# EAGLE design door_FM_rev_A (EAGLE 9.5.2)
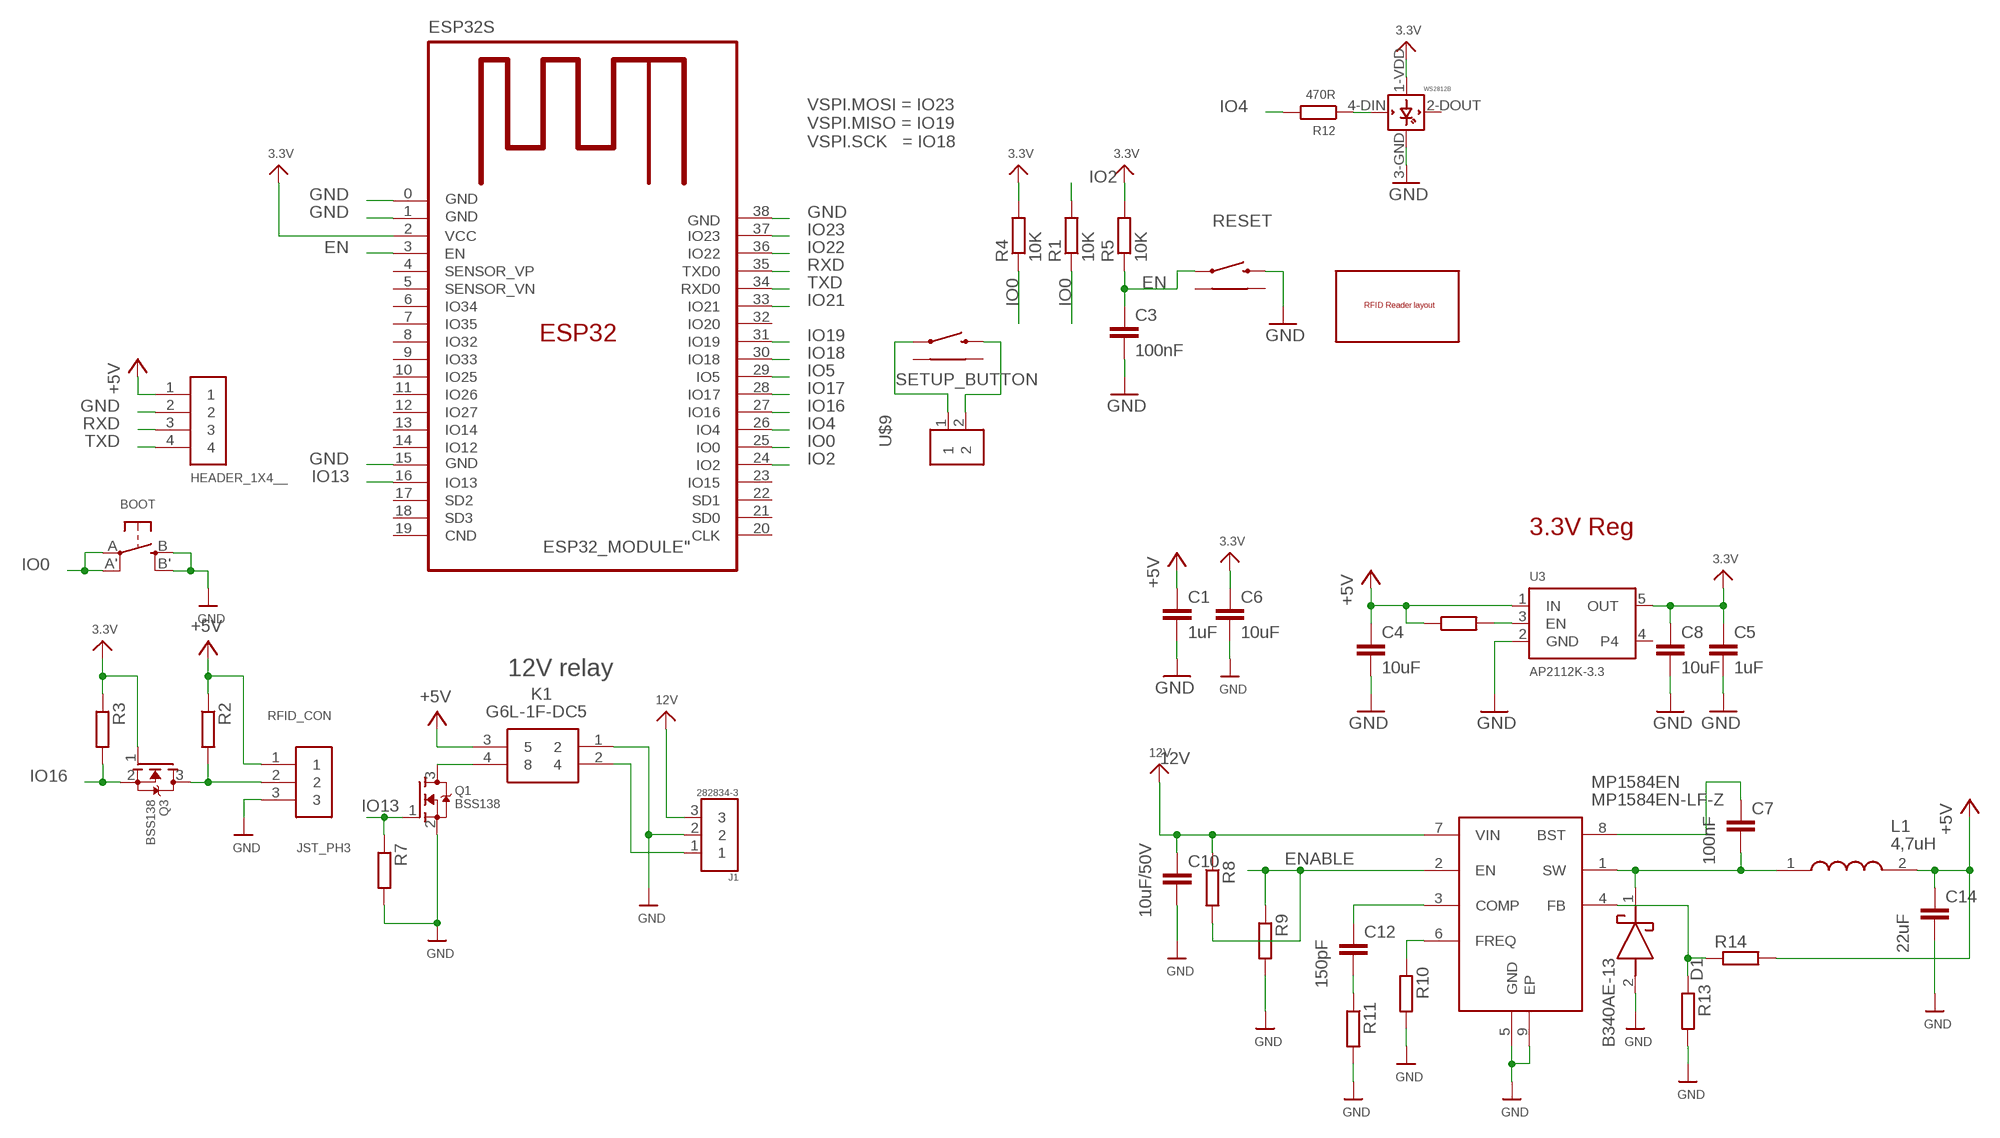
[diagram p0: schematic, sheet 1]

## Parts
BOOT  BUTTON_KMR2_4.6X2.8  [BUTTON_KMR2_4.6X2.8]
C1  1uF  C-EUC0805  [C0805]
C3  100nF  C-EUC0805  [C0805]
C4  10uF  C-EUC0805  [C0805]
C5  1uF  C-EUC0805  [C0805]
C6  10uF  C-EUC0805  [C0805]
C7  100nF  C-EUC0805  [C0805]
C8  10uF  C-EUC0805  [C0805]
C10  10uF/50V  C-EUC0805  [C0805]
C12  150pF  C-EUC0805  [C0805]
C14  22uF  C-EUC0805  [C0805]
CN1  HEADER_1X4__  [HEADER_1X4_RIGHT_ANGLE]
D1  B340AE-13  [DIOM5226X240N]
ESP32S  ESP32_MODULE"  [ESP32_MODULE]
J1  282834-3  [TE_282834-3]
K1  G6L-1F-DC5  [G6L-1F-DC5]
L1  4,7uH  ASPI-0630LR-4R7M-T15  [ASPI-0630LR]
MP1584EN  MP1584EN-LF-Z  [SOIC127P600X170-9N]
Q1  BSS138  MOSFET_N_  [SOT95P240X110-3]
Q3  BSS138  MOSFET_N_  [SOT95P240X110-3]
R1  10K  R-EU_R0805  [R0805]
R2  10K  R-EU_R0805  [R0805]
R3  10K  R-EU_R0805  [R0805]
R4  10K  R-EU_R0805  [R0805]
R5  10K  R-EU_R0805  [R0805]
R7  10K  R-EU_R0805  [R0805]
R8  100K  R-EU_R0805  [R0805]
R9  24,9K  R-EU_R0805  [R0805]
R10  100K  R-EU_R0805  [R0805]
R11  100K  R-EU_R0805  [R0805]
R12  470R  R-EU_R0805  [R0805]
R13  40,2K  R-EU_R0805  [R0805]
R14  210K  R-EU_R0805  [R0805]
R19  10K  R-EU_R0805  [R0805]
RESET  TACTILE_SWITCH_RIGHT_ANGLE_THT_  [TACTILE_SWITCH_RIGHT_ANGLE_THT]
RFID_CON  JST_PH3  [JST-PH3]
SETUP_BUTTON  TACTILE_SWITCH_RIGHT_ANGLE_THT_  [TACTILE_SWITCH_RIGHT_ANGLE_THT]
U3  AP2112K-3.3  AP2112K-3.3_  [SOT95P290X120-5]
U$9  282834-2  [CONN_282834-2]
U$10  RFID_READER  [RFID_READER]
WS2812B  WS2812B__  [WS2812B_5050]

## Nets
3.3V: C5.1 C6.1 C8.1 ESP32S.2(VCC) Q3.1(G) R3.1 R4.2 R5.2 U3.5(OUT) WS2812B.1-VDD(VDD)
12V: C10.1 J1.3 MP1584EN.7(VIN) R8.1
+5V: C1.1 C4.1 C14.1 CN1.1 K1.3 L1.2 R2.1 R14.2 R19.1 RFID_CON.1 U3.1(IN)
EN: C3.1 ESP32S.3(EN) R5.1 RESET.1
ENABLE: MP1584EN.2(EN) R8.2 R9.1
GND: BOOT.B'(S1) BOOT.B(S) C1.2 C3.2 C4.2 C5.2 C6.2 C8.2 C10.2 C14.2 CN1.2 D1.2(A) ESP32S.0(GND) ESP32S.1(GND) ESP32S.15(GND) ESP32S.38(GND) J1.2 K1.1 MP1584EN.5(GND) MP1584EN.9(EP) Q1.2(S) R7.2 R9.2 R10.2 R11.2 R13.2 RESET.2 RFID_CON.3 U3.2(GND) WS2812B.3-GND(GND)
IO0: BOOT.A'(P1) BOOT.A(P) ESP32S.25(IO0) R1.1 R4.1
IO2: ESP32S.24(IO2) R1.2
IO4: ESP32S.26(IO4) R12.2
IO5: ESP32S.29(IO5)
IO13: ESP32S.16(IO13) Q1.1(G) R7.1
IO16: ESP32S.27(IO16) Q3.2(S) R3.2
IO17: ESP32S.28(IO17)
IO18: ESP32S.30(IO18)
IO19: ESP32S.31(IO19)
IO21: ESP32S.33(IO21)
IO22: ESP32S.36(IO22)
IO23: ESP32S.37(IO23)
N$1: K1.4 Q1.3(D)
N$2: SETUP_BUTTON.1 U$9.1
N$3: SETUP_BUTTON.2 U$9.2
N$5: J1.1 K1.2
N$6: MP1584EN.6(FREQ) R10.1
N$7: Q3.3(D) R2.2 RFID_CON.2
N$8: C12.2 R11.1
N$9: C12.1 MP1584EN.3(COMP)
N$10: R12.1 WS2812B.4-DIN(DIN)
N$11: MP1584EN.4(FB) R13.1 R14.1
N$12: C7.2 D1.1(K) L1.1 MP1584EN.1(SW)
N$13: C7.1 MP1584EN.8(BST)
N$16: R19.2 U3.3(EN)
RXD: CN1.3 ESP32S.35(TXD0)
TXD: CN1.4 ESP32S.34(RXD0)
Unconnected: ESP32S.4(SENSOR_VP) ESP32S.5(SENSOR_VN) ESP32S.6(IO34) ESP32S.7(IO35) ESP32S.8(IO32) ESP32S.9(IO33) ESP32S.10(IO25) ESP32S.11(IO26) ESP32S.12(IO27) ESP32S.13(IO14) ESP32S.14(IO12) ESP32S.17(SD2) ESP32S.18(SD3) ESP32S.19(CND) ESP32S.20(CLK) ESP32S.21(SD0) ESP32S.22(SD1) ESP32S.23(IO15) ESP32S.32(IO20) RESET.ANCHOR1 RESET.ANCHOR2 SETUP_BUTTON.ANCHOR1 SETUP_BUTTON.ANCHOR2 U3.4 WS2812B.2-DOUT(DOUT)

## Notes on the sheet
- VSPI.MOSI = IO23
  VSPI.MISO = IO19
  VSPI.SCK   = IO18
- 3.3V Reg
- 12V relay

## Library data of the parts
BOOT = dronecz:BUTTON_KMR2_4.6X2.8: SMT Tact Switches 6x6mm - Digikey: P12940SCT-ND KMR2 (4.6x2.8mm) - Digikey: 401-1426-1-ND EVQ-PQHB55 - Light Touch, 160GF (4.5x4.5mm) - Digikey: P8090SCT-ND Farnell (KMR221NG) - 2845727
C1 C3-C8 C10 C12 C14 = rcl:C-EU: CAPACITOR, European symbol; SPICEPREFIX: C
CN1 = dronecz:HEADER_1X4
D1 = samacsys_parts:B340AE-13: Schottky Diodes & Rectifiers Schottky Rectifier. 40V; 3A Source: Datasheet <https://componentsearchengine.com/Datasheets/1/B340AE-13.pdf>; DESCRIPTION: Schottky Diodes & Rectifiers Schottky Rectifier. 40V; 3A; HEIGHT: 2.4mm; MANUFACTURER_NAME: Diodes Inc.; MANUFACTURER_PART_NUMBER: B340AE-13; MOUSER_PART_NUMBER: 621-B340AE-13; MOUSER_PRICE-STOCK: https://www.mouser.com/Search/Refine.aspx?Keyword=621-B340AE-13
ESP32S = dronecz:ESP32_MODULE
J1 = dronecz:282834-3: Conn; Term Blk; PCB; Wire Receptacle; 3; 2.54mm; 30-16AWG; Green; 10A; 150V; M1.6; AVAILABILITY: Unavailable; COMMENT: 282834-3; DESCRIPTION: 3 Position Wire to Board Terminal Block Horizontal with Board 0.100 _2.54mm_; EU_ROHS_COMPLIANCE: Compliant with Exemptions; MF: TE Connectivity; MP: 282834-3; PACKAGE: None; PRICE: None; TE_PURCHASE_URL: https://www.te.com/usa-en/product-282834-3.html?te_bu=Cor&te_type=disp&te_campaign=seda_glo_cor-seda-global-disp-prtnr-fy19-seda-model-bom-cta_sma-317_1&elqCampaignId=32493
K1 = dronecz:G6L-1F-DC5: Low Signal Relays - PCB LO PROF SPST 5VDC Source: Datasheet <https://componentsearchengine.com/Datasheets/1/G6L-1F-DC5.pdf>; DESCRIPTION: Low Signal Relays - PCB LO PROF SPST 5VDC; HEIGHT: mm; MANUFACTURER_NAME: Omron Electronics; MANUFACTURER_PART_NUMBER: G6L-1F-DC5; MOUSER_PART_NUMBER: 653-G6L-1F-DC5; MOUSER_PRICE-STOCK: https://www.mouser.com/Search/Refine.aspx?Keyword=653-G6L-1F-DC5
L1 = samacsys_parts:ASPI-0630LR-4R7M-T15: Fixed Inductors 4.7uH 20% -55C +125C Source: Datasheet <https://componentsearchengine.com/Datasheets/1/ASPI-0630LR-4R7M-T15.pdf>; DESCRIPTION: Fixed Inductors 4.7uH 20% -55C +125C; HEIGHT: mm; MANUFACTURER_NAME: ABRACON; MANUFACTURER_PART_NUMBER: ASPI-0630LR-4R7M-T15; MOUSER_PART_NUMBER: 815-ASPI0630LR4R7T15; MOUSER_PRICE-STOCK: https://www.mouser.com/Search/Refine.aspx?Keyword=815-ASPI0630LR4R7T15
MP1584EN = samacsys_parts:MP1584EN-LF-Z: Switching Voltage Regulators 3A 1.5MHz 28V Nonsync Buck Source: Datasheet <https://componentsearchengine.com/Datasheets/1/MP1584EN-LF-Z.pdf>; DESCRIPTION: Switching Voltage Regulators 3A 1.5MHz 28V Nonsync Buck; HEIGHT: 1.7mm; MANUFACTURER_NAME: Monolithic Power Systems (MPS); MANUFACTURER_PART_NUMBER: MP1584EN-LF-Z; MOUSER_PART_NUMBER: 946-MP1584ENLFZ; MOUSER_PRICE-STOCK: https://www.mouser.com/Search/Refine.aspx?Keyword=946-MP1584ENLFZ
Q1 Q3 = dronecz:MOSFET_N
R1-R5 R7-R14 R19 = rcl:R-EU_: RESISTOR, European symbol; SPICEPREFIX: R
RESET SETUP_BUTTON = dronecz:TACTILE_SWITCH_RIGHT_ANGLE_THT
RFID_CON = dronecz:JST_PH3
U3 = dronecz:AP2112K-3.3
U$9 = dronecz:282834-2: Terminal block; 2.54mm; angled 90°; 0.03÷1mm2; ways: 2; 10A; H: 10mm; AVAILABILITY: Unavailable; CENTERLINE_PITCH: 2.54 mm[.1 in]; COMMENT: 282834-2; DESCRIPTION: Wire-To-Board Terminal Block, 2, 150 V, 10 A, 30 Awg, 16 Awg, 1.4 Mm; EU_ROHS_COMPLIANCE: Compliant with Exemptions; MF: TE Connectivity; MP: 282834-2; NUMBER_OF_POSITIONS: 2; PACKAGE: None; PRICE: None; TE_PURCHASE_URL: https://www.te.com/usa-en/product-282834-2.html?te_bu=Cor&te_type=disp&te_campaign=seda_glo_cor-seda-global-disp-prtnr-fy19-seda-model-bom-cta_sma-317_1&elqCampaignId=32493
U$10 = dronecz:RFID_READER
WS2812B = dronecz:WS2812B

## Net classes
1 power: width 0.61 mm, drill 0.406 mm, clearance 0.203 mm
2 gnd: width 0.305 mm, drill 0.406 mm, clearance 0.203 mm
3 power usb: width 0.508 mm, drill 0.406 mm, clearance 0.203 mm

## Board
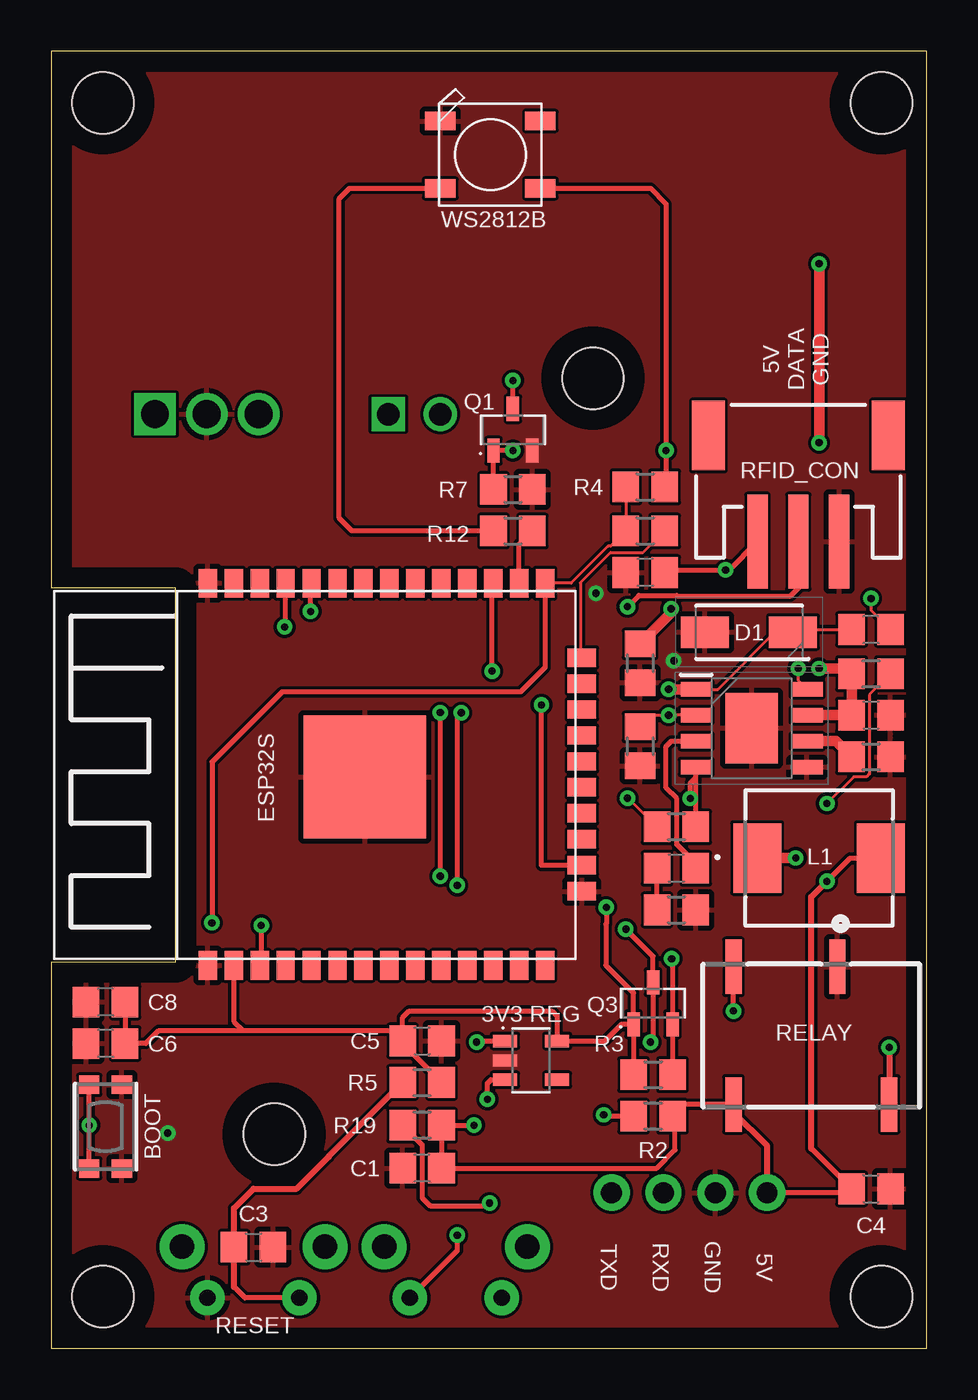
[diagram p1: board, top side]
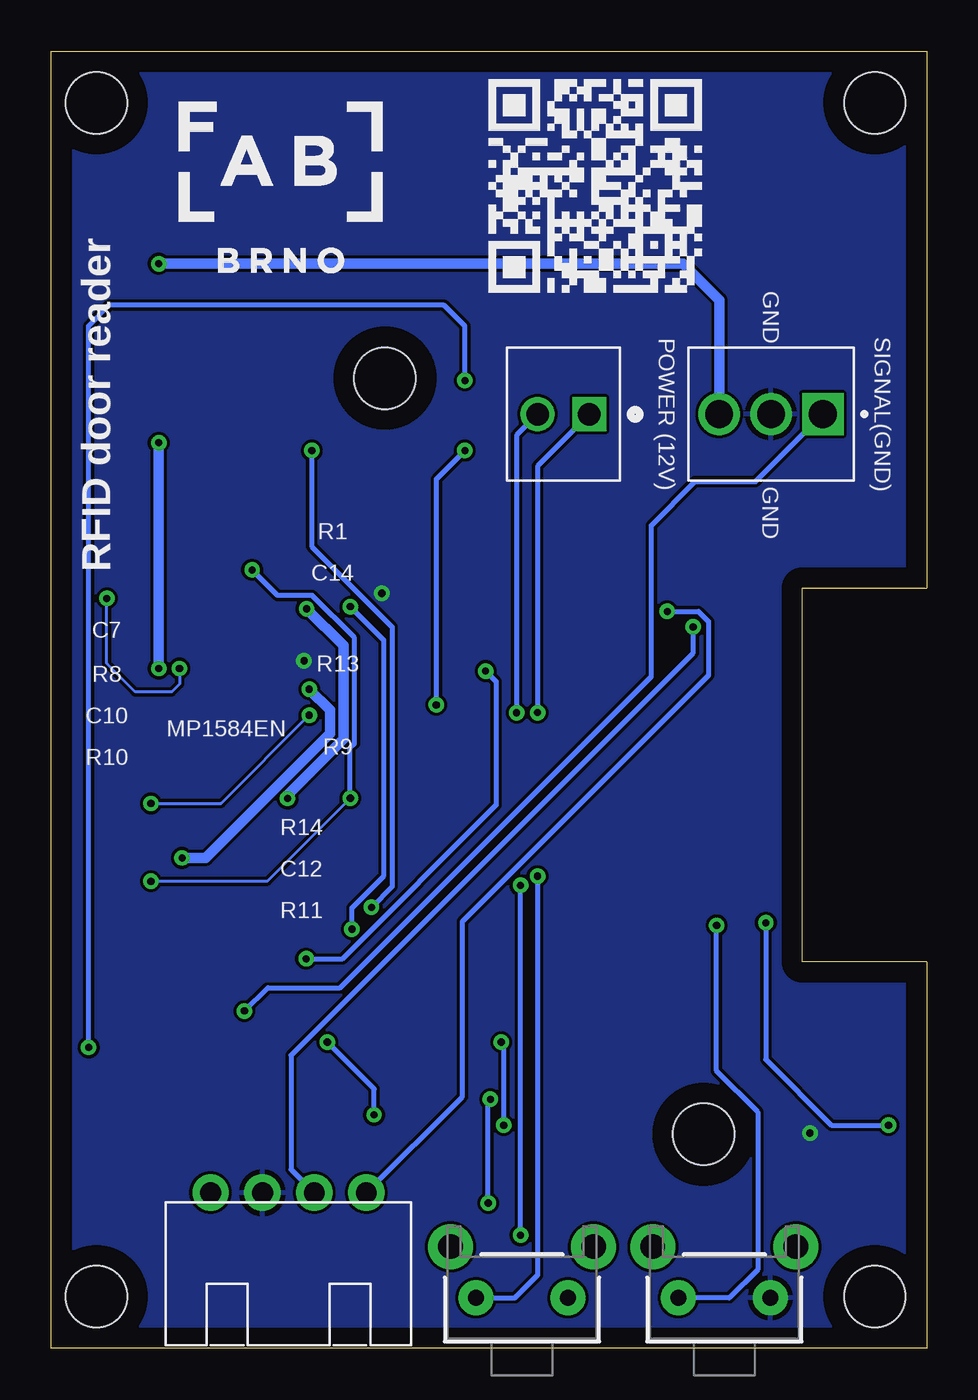
[diagram p2: board, bottom side, seen from below]

Size 42.86 x 63.49 mm. Coordinates in mm from the lower left corner, seen from the top.
Outline: 0,0 42.86,0 42.86,63.49 0,63.49 0,37.21 6.1,37.21 6.1,18.92 0,18.92 0,0
Copper layers (1*16): Top 0.035mm / dielectric 1.5mm / Bottom 0.035mm
Design rules "default": minimum track width 6mil, minimum drill 0.35mm, track to track 6mil, track to pad 6mil, pad to pad 6mil, via to via 6mil, smd to smd 6mil, copper to edge 40mil, drill to drill 6mil, minimum pad ring 10mil, minimum via ring 8mil, stop-mask expansion 4mil, vias tented up to drill 0mil, thermal gap 10mil
Holes 3 mm at 2.54,2.54 40.64,2.54 40.64,60.96 2.54,60.96

### Footprints (pad centres in the part's own frame; a part is rotated, then mirrored left to right if it is on the bottom)
BUTTON_KMR2_4.6X2.8 = smd 0.9 x 1: A 2.05,0.8; A' -2.05,0.8; B 2.05,-0.8; B' -2.05,-0.8
C0805 = smd 1.3 x 1.5: 1 -0.95,0; 2 0.95,0
HEADER_1X4_RIGHT_ANGLE = drill 1.016 pad 1.778: 1 -3.81,0; 2 -1.27,0; 3 1.27,0; 4 3.81,0
DIOM5226X240N = smd 2.35 x 1.55: 1 -2.15,0; 2 2.15,0
ESP32_MODULE = smd 6 x 6: 0 0.026,-0.121 | smd 1.4 x 0.9: 1 -9.194,7.569; 2 -9.194,6.298; 3 -9.194,5.029; 4 -9.194,3.759; 5 -9.194,2.489; 6 -9.194,1.218; 7 -9.194,-0.051; 8 -9.194,-1.321; 9 -9.194,-2.591; 10 -9.194,-3.861; 11 -9.194,-5.131; 12 -9.194,-6.402; 13 -9.194,-7.671; 14 -9.194,-8.941; 25 9.507,-8.941; 26 9.507,-7.671; 27 9.507,-6.402; 28 9.507,-5.131; 29 9.507,-3.861; 30 9.507,-2.591; 31 9.507,-1.321; 32 9.507,-0.051; 33 9.507,1.218; 34 9.507,2.489; 35 9.507,3.759; 36 9.507,5.029; 37 9.507,6.298; 38 9.507,7.569 | smd 0.9 x 1.4: 15 -5.564,-10.742; 16 -4.293,-10.742; 17 -3.023,-10.742; 18 -1.754,-10.742; 19 -0.483,-10.742; 20 0.786,-10.742; 21 2.057,-10.742; 22 3.326,-10.742; 23 4.596,-10.742; 24 5.867,-10.742
TE_282834-3 = drill 1.36 square: 1 0,0 | drill 1.36: 2 2.54,0; 3 5.08,0
G6L-1F-DC5 = smd 0.8 x 2.66: 1 -5.08,-6.74; 2 0,-6.74; 3 0,0; 4 -7.62,0
ASPI-0630LR = smd 2.35 x 3.4: 1 -3.025,0; 2 3.025,0
SOIC127P600X170-9N = smd 1.525 x 0.7: 1 -2.712,1.905; 2 -2.712,0.635; 3 -2.712,-0.635; 4 -2.712,-1.905; 5 2.712,-1.905; 6 2.712,-0.635; 7 2.712,0.635; 8 2.712,1.905 | smd 2.56 x 3.45: 9 0,0
SOT95P240X110-3 = smd 1.18 x 0.609: 1 -1.024,0.95; 2 -1.024,-0.95; 3 1.024,0
R0805 = smd 1.3 x 1.5: 1 -0.95,0; 2 0.95,0
TACTILE_SWITCH_RIGHT_ANGLE_THT = drill 0.8 pad 1.7: 1 2.25,0; 2 -2.25,0 | drill 1.2 pad 2.2: ANCHOR1 3.5,-2.5; ANCHOR2 -3.5,-2.5
JST-PH3 = smd 1 x 4.6: 1 -2,-3.7; 2 0,-3.7; 3 2,-3.7 | smd 1.6 x 3.4: NC1 -4.4,1.5; NC2 4.4,1.5
SOT95P290X120-5 = smd 1.18 x 0.609: 1 -1.274,0.95; 2 -1.274,0; 3 -1.274,-0.95; 4 1.274,-0.95; 5 1.274,0.95
CONN_282834-2 = drill 1.1 square: 1 -1.27,0 | drill 1.1: 2 1.27,0
RFID_READER = hole 3: 5.4,21; 42.4,5.4
WS2812B_5050 = smd 1.5 x 0.9: 1-VDD 2.45,-1.65; 2-DOUT 2.45,1.65; 3-GND -2.45,1.65; 4-DIN -2.45,-1.65

### Placement (x,y rotation side)
BOOT  2.67,10.86 90 top
C1  18.16,8.82 180 top
C3  9.91,4.95 0 top
C4  40.13,7.81 0 top
C5  18.16,15.05 0 top
C6  2.67,14.92 180 top
C7  40.13,35.18 180 top
C8  2.67,16.95 180 top
C10  40.13,30.99 0 top
C12  30.61,23.5 180 top
C14  29.08,37.97 180 top
CN1  31.24,7.62 0 bottom
D1  34.16,35.05 180 top
ESP32S  15.24,27.94 90 top
J1  5.08,45.72 180 bottom
K1  33.4,11.94 180 top
L1  37.59,24 0 top
MP1584EN  34.29,30.35 0 top
Q1  22.61,44.96 90 top
Q3  29.46,16.89 90 top
R1  29.08,40.01 0 top
R2  29.46,11.37 180 top
R3  29.46,13.4 0 top
R4  29.08,42.16 0 top
R5  18.16,13.02 0 top
R7  22.61,42.04 0 top
R8  40.13,33.02 0 top
R9  28.83,29.46 270 top
R10  40.13,28.96 0 top
R11  30.61,21.46 0 top
R12  22.61,40.01 0 top
R13  28.83,33.53 270 top
R14  30.61,25.53 180 top
R19  18.16,10.92 180 top
RESET  9.91,2.48 180 bottom
RFID_CON  36.58,43.18 0 top
SETUP_BUTTON  19.81,2.48 180 bottom
U3  23.5,14.1 0 top
U$9  17.78,45.72 180 bottom
U$10  31.92,5.08 90 top
WS2812B  21.5,58.42 0 top

### Tracks (layer width: path | path; a pad name or v marks a point on that pad's centre or on a via)
3.3V  (via drill 0.35)
  Top 0.254: Q3.1 R3.1 | Q3.1 28.51,17.39 27.15,18.75 27.15,20.75 27.18,20.78 v27.18,21.59 | ESP32S.2 8.94,16.02 9.4,15.56 10.16,15.56 | R4.2 30.1,42.23 v30.1,43.94 30.1,56.01 29.34,56.77 WS2812B.1-VDD | Q3.1 27.94,15.88 27.11,15.05 U3.5 24.77,16.25 24.51,16.51 17.53,16.51 17.21,16.2 C5.1 | R5.2 17.21,14.92 C5.1 | C5.1 16.7,15.56 10.16,15.56 | 10.16,15.56 5.27,15.56 4.63,14.92 C6.1 C8.1
  Bottom 0.254: v30.1,43.94 30.1,39.24 26.16,35.31 26.16,22.61 v27.18,21.59
12V  (via drill 0.35)
  Top 0.508: MP1584EN.7 C10.1 R8.1 38.93,33.27 v37.59,33.27 | v37.59,53.09 v37.59,44.32
  Bottom 0.508: J1.3 10.16,51.31 11.94,53.09 v37.59,53.09 | v37.59,44.32 v37.59,33.27
+5V  (via drill 0.35)
  Top 0.152: R14.2 28.26,26.92 v28.22,26.92
  Top 0.254: K1.3 30.99,11.94 30.54,11.49 | R2.1 30.54,11.49 | v37.97,22.86 39.12,24 L1.2 | C14.1 30.16,38.1 v33.02,38.1 33.2,38.1 RFID_CON.1 | 30.54,11.49 30.54,9.71 29.65,8.82 C1.1 R19.1 v20.7,10.92 | v20.83,14.99 20.89,15.05 U3.1 | CN1.1 38.99,7.62 C4.1 37.21,9.78
  Top 0.305: v37.97,22.86 37.21,22.1 37.21,10.16 37.21,9.78 | CN1.1 35.05,9.91 33.4,11.56 K1.3
  Bottom 0.152: v28.22,26.92 32.28,22.86 v37.97,22.86
  Bottom 0.254: v28.22,26.92 28.22,29.4 28.02,29.61 28.02,34.79 30.08,36.85 31.77,36.85 v33.02,38.1 | v20.7,10.92 20.7,14.86 v20.83,14.99
EN  (via drill 0.35)
  Top 0.254: ESP32S.3 10.29,18.82 v10.29,20.7 | RESET.1 9.49,2.48 8.96,3.01
  Top 0.305: 8.96,3.01 C3.1 8.96,6.86 9.91,7.81 12.03,7.81 13.59,9.38 13.59,9.4 R5.1
  Bottom 0.254: v10.29,20.7 10.29,13.59 8.28,11.57 8.28,3.86 9.66,2.48 RESET.1
ENABLE  (via drill 0.35)
  Top 0.152: R8.2 40.06,32 40.06,28.11 39.93,27.98 39.28,27.98 v37.97,26.67 | MP1584EN.2 v30.23,30.99 29.4,30.99 R9.1
  Bottom 0.152: v37.97,26.67 34.54,26.67 v30.23,30.99
GND  (via drill 0.35)
  other vias: 5.71,10.54 26.67,36.96 30.48,33.66
  pour Top (rank 2): 0,0 43.05,0 43.05,63.5 0,63.5
  pour Bottom (rank 2): 0,0 42.93,0 42.93,63.5 0,63.5
IO0  (via drill 0.35)
  Top 0.152: ESP32S.25 25.45,37.45 27.26,39.26 27.38,39.26 R1.1 R4.1
  Top 0.254: BOOT.A' v1.87,10.92 BOOT.A | ESP32S.25 24.18,33.33 22.99,32.13 11.3,32.13 7.87,28.7 v7.87,20.83
  Bottom 0.254: v7.87,20.83 7.87,14.13 4.66,10.92 v1.87,10.92
IO2
  Top 0.152: R1.2 28.98,38.95 27.39,38.95 25.91,37.47 25.91,33.88 ESP32S.24
IO4
  Top 0.254: ESP32S.26 22.91,39.36 R12.2
IO13  (via drill 0.35)
  Top 0.254: ESP32S.16 24,23.65 v24,31.5 | R7.1 Q1.1 22.6,43.93 v22.61,43.94
  Bottom 0.254: v24,31.5 24,42.55 v22.61,43.94
IO16  (via drill 0.35)
  Top 0.254: R3.2 Q3.2 30.41,19.03 v30.37,19.07 | v21.59,33.15 21.59,37.4 ESP32S.27
  Bottom 0.254: v30.37,19.07 28.59,19.07 21.08,26.58 21.08,32.64 v21.59,33.15
N$1  (via drill 0.35)
  Top 0.254: Q1.3 v22.61,47.37
  Top 0.305: v41.02,14.73 K1.4
  Bottom 0.254: v22.61,47.37 22.61,50.04 23.62,51.05 40.01,51.05 41.02,50.04 v41.02,14.73
N$2  (via drill 0.35)
  Top 0.254: v19.05,23.11 v19.05,31.11
  Bottom 0.254: U$9.1 19.05,43.18 v19.05,31.11 | SETUP_BUTTON.1 20.15,2.48 19.05,3.58 v19.05,23.11
N$3  (via drill 0.35)
  Top 0.254: v19.88,22.66 19.88,30.92 v20.07,31.11 | SETUP_BUTTON.2 19.88,4.8 v19.88,5.54
  Bottom 0.254: v19.88,5.54 v19.88,22.66 | U$9.2 20.07,44.7 v20.07,31.11
N$5  (via drill 0.35)
  Top 0.254: v33.4,16.51 K1.2
  Bottom 0.254: v33.4,16.51 32.26,17.65 28.7,17.65 13.48,32.87 13.48,40.28 11.34,42.42 8.38,42.42 J1.1
N$6
  Top 0.508: MP1584EN.6 38.42,29.72 R10.1
N$7  (via drill 0.35)
  Top 0.254: v29.34,14.99 29.46,15.11 Q3.3 29.46,19.19 v28.14,20.52 | R2.2 27.12,11.37 v27.05,11.43 | RFID_CON.2 36.58,37.21 36.2,36.83 30.65,36.83 30.62,36.85 28.77,36.85 v28.21,36.3
  Bottom 0.254: v29.34,14.99 27.05,12.7 v27.05,11.43 | v28.14,20.52 28.14,21.56 26.57,23.13 26.57,34.66 v28.21,36.3
N$8
  Top 0.254: R11.1 C12.2
N$9
  Top 0.254: C12.1 31.56,23.73 30.63,24.66 30.63,26.9 30.1,27.43 30.1,29.46 30.35,29.72 MP1584EN.3
N$10
  Top 0.254: R12.1 14.73,40.01 14.1,40.64 14.1,56.26 14.61,56.77 WS2812B.4-DIN
N$11  (via drill 0.35)
  Top 0.254: R14.1 31.56,27.94 | 31.56,27.94 31.56,28.43 MP1584EN.4 | v31.29,26.91 31.29,27.67 31.56,27.94
  Top 0.508: v30.35,36.2 30.35,36 R13.1
  Bottom 0.508: v31.29,26.91 31.29,27.09 28.55,29.82 28.55,34.39 v30.35,36.2
N$12  (via drill 0.35)
  Top 0.152: C7.2 36.44,35.18 D1.1 35.43,35.05 32.64,32.26 MP1584EN.1
  Top 0.508: MP1584EN.1 v30.23,32.26 | v36.45,24 L1.1
  Bottom 0.508: v30.23,32.26 29.21,31.24 29.21,30.1 35.31,24 v36.45,24
N$13  (via drill 0.35)
  Top 0.152: MP1584EN.8 36.58,32.68 v36.58,33.27 | C7.1 40.13,36.13 v40.13,36.7
  Bottom 0.152: v36.58,33.27 36.58,32.51 36.96,32.13 38.73,32.13 40.13,33.53 v40.13,36.7
N$16  (via drill 0.35)
  Top 0.254: R19.2 18.16,9.97 18.16,7.37 18.54,6.99 21.34,6.99 v21.46,7.11 | v21.36,12.19 21.36,12.98 21.53,13.15 U3.3
  Bottom 0.254: v21.46,7.11 21.46,12.09 v21.36,12.19
RXD  (via drill 0.35)
  Top 0.254: v11.43,35.31 11.48,35.36 ESP32S.35
  Bottom 0.254: v11.43,35.31 11.43,34.04 31.11,14.35 31.11,8.76 CN1.3
TXD  (via drill 0.35)
  Top 0.254: v12.7,36.07 12.7,37.4 ESP32S.34
  Bottom 0.254: CN1.4 22.73,12.32 22.73,20.89 10.67,32.95 10.67,35.56 11.18,36.07 v12.7,36.07

### Text on the board
tPlace: 3V3 REG | RELAY
bPlace: RFID door reader
tNames: 5V / DATA / GND | TXD | RXD | GND | 5V
bNames: GND | SIGNAL(GND) | POWER (12V) | GND